# Altium schematic sheet Current_SenseSchematic.SchDoc (part 2 of 3)
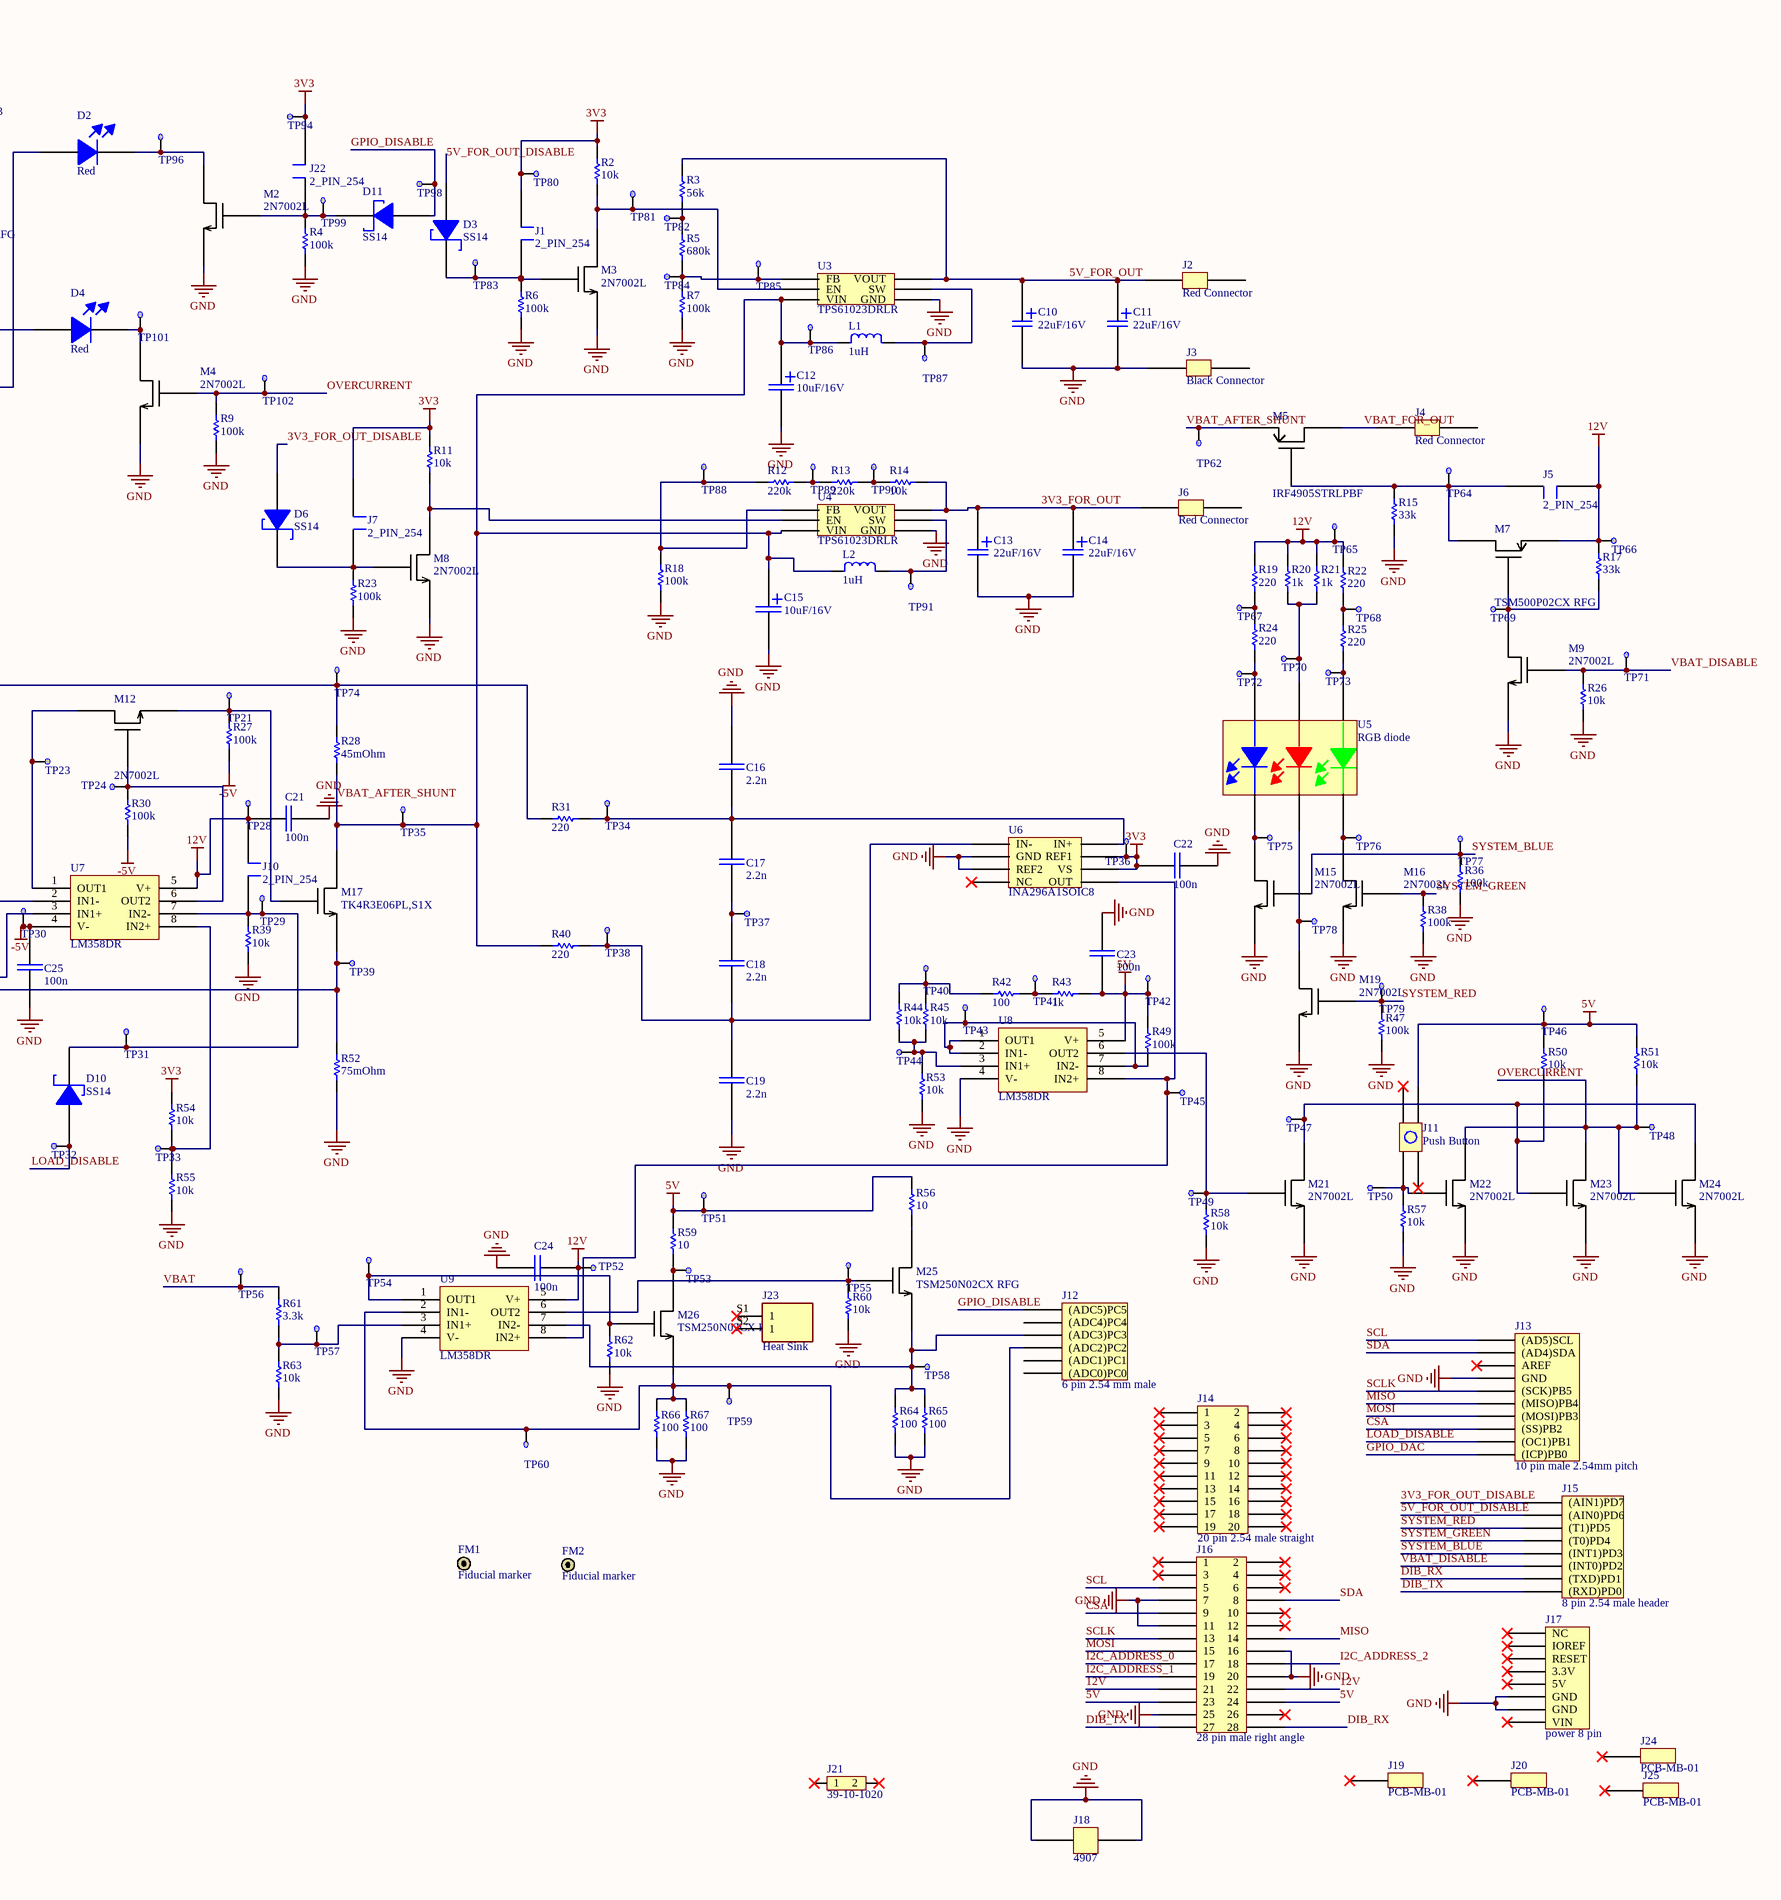
[diagram p2: Current_SenseSchematic.SchDoc, right]
## Library data of the parts
C1 C8 C9 = C1206C105K5RACTU: Multilayer Ceramic Capacitor, 1 uF, 50 V, ± 10%, X7R, 1206 [3216 Metric]; Manufacturer: KEMET; Voltage: 50V; Supplier: Farnell; Supplier Part Number: 1288207; Manufacturer Part Number: C1206C105K5RACTU; RoHS: Yes; Category: Ceramic Capacitors; Stock: 92059; Pricing: 10=0.106, 100=0.065, 500=0.057, 1000=0.05 (GBP); Mounting Technology: Surface Mount; Case/Package: 1206; Pins: 2; Case Code (Imperial): 1206; Case Code (Metric): 3216; Dielectric Material: Ceramic; Min Operating Temperature: -55°C; Max Operating Temperature: 125°C; Value: 1uF; Tolerance: 10%; Packaging: Tape and Reel; Dielectric: X7R; Termination: SMD/SMT; Package Quantity: 1; Voltage Rating: 50V; Voltage Rating (DC): 50V; Series: C; Construction: Flat; Voltage Rating (AC): 50V; Length: 3.2mm; Width: 0.063inch; Height: 1mm; Depth: 1.6mm; Thickness: 0.043inch; Radiation Hardening: No; Reach SVHC Compliant: No; RoHS Compliant: Yes; ComponentLink1URL: https://datasheet.ciiva.com/6074/kem-c1002-x7r-smd-6074697.pdf?src-supplier=Farnell; ComponentLink1Description: https://datasheet.ciiva.com/6074/kem-c1002-x7r-smd-6074697.pdf?src-supplier=Farnell; ComponentLink2URL: https://datasheet.ciiva.com/7730/kem-c1002-x7r-smd-7730086.pdf?src-supplier=Element14; ComponentLink2Description: https://datasheet.ciiva.com/7730/kem-c1002-x7r-smd-7730086.pdf?src-supplier=Element14; ComponentLink3URL: https://datasheet.ciiva.com/22749/1918693-22749725.pdf?src-supplier=Element14; ComponentLink3Description: https://datasheet.ciiva.com/22749/1918693-22749725.pdf?src-supplier=Element14
C2 = 12061A332FAT2A: Cap Ceramic 0.0033uF 100V C0G 1% SMD 1206 125°C Embossed T/R; Manufacturer: Kyocera AVX; Supplier: Mouser; Supplier Part Number: 581-12061A332FAT2A; Manufacturer Part Number: 12061A332FAT2A; RoHS: Yes; Category: Ceramic Capacitors; Stock: 5389; ComponentLink1URL: https://datasheet.ciiva.com/11536/ccog-11536655.pdf?src-supplier=Avnet; ComponentLink1Description: https://datasheet.ciiva.com/11536/ccog-11536655.pdf?src-supplier=Avnet; ComponentLink2URL: https://datasheet.ciiva.com/218/ccog-218522.pdf?src-supplier=Digi-Key; ComponentLink2Description: https://datasheet.ciiva.com/218/ccog-218522.pdf?src-supplier=Digi-Key; Supplier 1: Mouser; Supplier Part Number 1: 581-12061A332FAT2A
C3 = 875585344001: Cap, 100Uf, 25V, Alu Elec, Hybrid, Smd Rohs Compliant: Yes |Wurth Elektronik 875585344001; Manufacturer: Wurth Electronics; ESR (Equivalent Series Resistance): 50mR; Leakage Current: 16uA; Ripple Current: 900mA; Voltage Rating: 16V; Supplier: Farnell; Supplier Part Number: 4171898; Manufacturer Part Number: 875585344001; RoHS: No; Category: Polymer Capacitors; Stock: 989; Pricing: 1=1.46, 50=1.25, 100=1.07, 250=0.957, 500=0.86, 1000=0.779, 5000=0.763, 10000=0.747 (GBP); Min Operating Temperature: -55°C; Max Operating Temperature: 125°C; Value: 100uF; Diameter: 6.3mm; Length: 5.8mm; Width: 6.5mm; Supplier 1: Mouser; Supplier Part Number 1: 710-875585344001
C4 = 12063C474JAT2A: Cap Ceramic 0.47uF 25V X7R 5% SMD 1206 125°C Embossed T/R; Manufacturer: Kyocera AVX; Supplier: Mouser; Supplier Part Number: 581-12063C474J; Manufacturer Part Number: 12063C474JAT2A; RoHS: Yes; Category: Ceramic Capacitors; Stock: 280; ComponentLink1URL: https://datasheet.ciiva.com/211/cx7r-211340.pdf?src-supplier=Digi-Key; ComponentLink1Description: https://datasheet.ciiva.com/211/cx7r-211340.pdf?src-supplier=Digi-Key; ComponentLink2URL: https://datasheet.ciiva.com/5426/cx7r-5426934.pdf?src-supplier=Mouser; ComponentLink2Description: https://datasheet.ciiva.com/5426/cx7r-5426934.pdf?src-supplier=Mouser
C5-C7 C20-C25 = 12065F104K4T2A: 1206 Standard 100nF Ceramic Multilayer Cap; 50VDC; +150C; X8R Dielectric; +/-10% SMD; Manufacturer: Kyocera AVX; Supplier: Farnell; Supplier Part Number: 4229722; Manufacturer Part Number: 12065F104K4T2A; RoHS: Yes; Category: Ceramic Capacitors; Stock: 8000; Pricing: 2000=0.063, 10000=0.045, 20000=0.044 (GBP); ComponentLink1URL: https://datasheet.ciiva.com/11787/0900766b80def347-11787814.pdf?src-supplier=Rs; ComponentLink1Description: https://datasheet.ciiva.com/11787/0900766b80def347-11787814.pdf?src-supplier=Rs; ComponentLink2URL: https://datasheet.ciiva.com/25796/55254-25796411.pdf?src-supplier=Farnell; ComponentLink2Description: https://datasheet.ciiva.com/25796/55254-25796411.pdf?src-supplier=Farnell; ComponentLink3URL: https://datasheet.ciiva.com/25796/55254-25796413.pdf?src-supplier=Farnell; ComponentLink3Description: https://datasheet.ciiva.com/25796/55254-25796413.pdf?src-supplier=Farnell; ComponentLink4URL: https://datasheet.ciiva.com/5411/cx8r-5411261.pdf?src-supplier=Mouser; ComponentLink4Description: https://datasheet.ciiva.com/5411/cx8r-5411261.pdf?src-supplier=Mouser; ComponentLink5URL: https://datasheet.ciiva.com/152/cauto-152120.pdf?src-supplier=Digikey; ComponentLink5Description: https://datasheet.ciiva.com/152/cauto-152120.pdf?src-supplier=Digikey; ComponentLink6URL: https://datasheet.ciiva.com/152/cauto-152121.pdf?src-supplier=Digikey; ComponentLink6Description: https://datasheet.ciiva.com/152/cauto-152121.pdf?src-supplier=Digikey; ComponentLink7URL: https://datasheet.ciiva.com/152/cauto-152122.pdf?src-supplier=Digikey; ComponentLink7Description: https://datasheet.ciiva.com/152/cauto-152122.pdf?src-supplier=Digikey; ComponentLink8URL: https://datasheet.ciiva.com/16315/cx8r-16315643.pdf?src-supplier=Future+Electronics; ComponentLink8Description: https://datasheet.ciiva.com/16315/cx8r-16315643.pdf?src-supplier=Future+Electronics
C10 C11 C13 C14 = MVJ16VC22RME60TP: Aluminum Electrolytic Capacitors - SMD 22uF 16V; Manufacturer: United Chemi-Con; Tolerance: 20%; Supplier: Mouser; Supplier Part Number: 661-MVJ16VC22RM; Manufacturer Part Number: MVJ16VC22RME60TP; RoHS: No; Category: Uncategorized; Case/Package: Aluminum; Min Operating Temperature: -40°C; Max Operating Temperature: 125°C; Packaging: Tape and Reel; Voltage Rating: 16V; Voltage Rating (DC): 16V; Value: 22uF; Package Quantity: 1000; Termination: SMD/SMT; Series: MVJ; Length: 5.7mm; RoHS Compliant: No; ComponentLink1URL: http://www.mouser.com/search/ProductDetail.aspx?r=661-EMVJ6R3ADA220MD6&countrycode=SB&currencycode=USD&src-supplier=Mouser; ComponentLink1Description: http://www.mouser.com/search/ProductDetail.aspx?r=661-EMVJ6R3ADA220MD6&countrycode=SB&currencycode=USD&src-supplier=Mouser
  C10: Supplier 1: Mouser; Supplier Part Number 1: 661-MVJ16VC22RM
C12 C15 = EEE-HA1C100R: Aluminum Electrolytic Capacitor, 10 uF, 16 V, ± 20%, 1000 hours @ 105°C, Radial Can - SMD; Manufacturer: Panasonic; Supplier: Farnell; Supplier Part Number: 2805786; Manufacturer Part Number: EEE-HA1C100R; RoHS: Yes; Category: Aluminum Electrolytic Capacitors; Stock: 4000; Pricing: 2000=0.05 (GBP); Width: 650um; Lead Free: 5697LeadFree; ComponentLink1URL: https://datasheet.ciiva.com/11777/0900766b8102e3f9-11777432.pdf?src-supplier=Rs; ComponentLink1Description: https://datasheet.ciiva.com/11777/0900766b8102e3f9-11777432.pdf?src-supplier=Rs; ComponentLink2URL: https://datasheet.ciiva.com/43459/1446029-43459815.pdf?src-supplier=Farnell; ComponentLink2Description: https://datasheet.ciiva.com/43459/1446029-43459815.pdf?src-supplier=Farnell; ComponentLink3URL: https://datasheet.ciiva.com/2983/aba0000ce3-2983985.pdf?src-supplier=Avnet; ComponentLink3Description: https://datasheet.ciiva.com/2983/aba0000ce3-2983985.pdf?src-supplier=Avnet; ComponentLink4URL: https://datasheet.ciiva.com/2985/aba0000ce3-2985640.pdf?src-supplier=Avnet; ComponentLink4Description: https://datasheet.ciiva.com/2985/aba0000ce3-2985640.pdf?src-supplier=Avnet; ComponentLink5URL: https://datasheet.ciiva.com/24071/aba0000ce3-259063-24071183.pdf?src-supplier=Mouser; ComponentLink5Description: https://datasheet.ciiva.com/24071/aba0000ce3-259063-24071183.pdf?src-supplier=Mouser; ComponentLink6URL: https://datasheet.ciiva.com/30262/33aba0000ce3-30262478.pdf?src-supplier=Onlinecomponents.com; ComponentLink6Description: https://datasheet.ciiva.com/30262/33aba0000ce3-30262478.pdf?src-supplier=Onlinecomponents.com; ComponentLink7URL: https://datasheet.ciiva.com/14593/70256712-14593785.pdf?src-supplier=Allied+Electronics; ComponentLink7Description: https://datasheet.ciiva.com/14593/70256712-14593785.pdf?src-supplier=Allied+Electronics; ComponentLink8URL: https://datasheet.ciiva.com/14604/70256712-14604238.pdf?src-supplier=Allied+Electronics; ComponentLink8Description: https://datasheet.ciiva.com/14604/70256712-14604238.pdf?src-supplier=Allied+Electronics; ComponentLink9URL: https://datasheet.ciiva.com/46376/1446029-46376825.pdf?src-supplier=Element14; ComponentLink9Description: https://datasheet.ciiva.com/46376/1446029-46376825.pdf?src-supplier=Element14; ComponentLink10URL: https://datasheet.ciiva.com/46386/1446029-46386252.pdf?src-supplier=Element14; ComponentLink10Description: https://datasheet.ciiva.com/46386/1446029-46386252.pdf?src-supplier=Element14
C16-C19 = 12065C222KAZ2A: 1206 2.2 nF 50V ±10 % Tolerance X7R Surface Mount Multilayer Ceramic Capacitor; Manufacturer: Kyocera AVX; Supplier: Mouser; Supplier Part Number: 581-12065C222KAZ2A; Manufacturer Part Number: 12065C222KAZ2A; RoHS: Yes; Category: Ceramic Capacitors; Stock: 2472; ComponentLink1URL: https://datasheet.ciiva.com/208/flexiterm-208276.pdf?src-supplier=Digi-Key; ComponentLink1Description: https://datasheet.ciiva.com/208/flexiterm-208276.pdf?src-supplier=Digi-Key; ComponentLink2URL: https://datasheet.ciiva.com/16315/cx7r-16315686.pdf?src-supplier=Future+Electronics; ComponentLink2Description: https://datasheet.ciiva.com/16315/cx7r-16315686.pdf?src-supplier=Future+Electronics
D1 D3 D6 D7 D10 D11 = SS14: SS14 Series 500 mV 1 A 40 V Max Reverse Voltage Schottky Rectifier - DO-214AC; Manufacturer: ON Semiconductor / Fairchild; Max Reverse Current: 200uA; Forward Current: 1A; Forward Voltage: 500mV; Max Repetitive Reverse Voltage (Vrrm): 40V; Max Forward Surge Current (Ifsm): 40A; Polarity: Standard; Supplier: Farnell; Supplier Part Number: 1467537; Manufacturer Part Number: SS14; RoHS: Yes; Category: Schottky Diodes; Stock: 4863; Pricing: 5=0.36, 10=0.272, 100=0.152, 500=0.103, 1000=0.0793, 2500=0.0707 (GBP); Mounting Technology: Surface Mount; Case/Package: DO-214AC; Pins: 2; Weight: 0.003739oz; Min Operating Temperature: -65°C; Max Operating Temperature: 125°C; Packaging: Tape and Reel; Package Quantity: 7500; Average Rectified Current: 1A; Peak Non-Repetitive Surge Current: 40A; Max Reverse Voltage (DC): 40V; Series: -; Termination: SMD/SMT; Voltage Rating (DC): 40V; Current Rating: 1A; Output Current: 1A; Current: 1A; Voltage: 40V; Length: 4.75mm; Width: 2.95mm; Height: 2.2mm; Radiation Hardening: No; Reach SVHC Compliant: No; RoHS Compliant: Yes; ComponentLink1URL: https://datasheet.ciiva.com/910/ss12-910696.pdf?src-supplier=Digi-Key; ComponentLink1Description: https://datasheet.ciiva.com/910/ss12-910696.pdf?src-supplier=Digi-Key; ComponentLink2URL: https://datasheet.ciiva.com/7965/1766303-7965241.pdf?src-supplier=Element14; ComponentLink2Description: https://datasheet.ciiva.com/7965/1766303-7965241.pdf?src-supplier=Element14; ComponentLink3URL: https://datasheet.ciiva.com/22651/1880990-22651980.pdf?src-supplier=Element14; ComponentLink3Description: https://datasheet.ciiva.com/22651/1880990-22651980.pdf?src-supplier=Element14
D2 D4 D8 = SML-LXL1206GC-TR: LED Red 20 mcd (Typ.) @ 25 C (Axial) 2.1 V (Typ.) @ 25 C (Forward) PCB; Manufacturer: Lumex; Supplier: Farnell; Supplier Part Number: 1610882; Manufacturer Part Number: SML-LXL1206GC-TR; RoHS: Yes; Category: LEDs; Stock: 1744; Pricing: 1=0.229, 25=0.166, 50=0.132, 100=0.0968, 250=0.0888, 500=0.0824, 1000=0.0743 (GBP); ComponentLink1URL: https://datasheet.ciiva.com/4689/sml-lxl1206gc-tr-115211-4689614.pdf?src-supplier=Mouser; ComponentLink1Description: https://datasheet.ciiva.com/4689/sml-lxl1206gc-tr-115211-4689614.pdf?src-supplier=Mouser; ComponentLink2URL: https://datasheet.ciiva.com/8073/sml-lxl1206gc-tr-8073089.pdf?src-supplier=Element14; ComponentLink2Description: https://datasheet.ciiva.com/8073/sml-lxl1206gc-tr-8073089.pdf?src-supplier=Element14; ComponentLink3URL: https://datasheet.ciiva.com/8072/sml-lxl1206gc-tr-8072901.pdf?src-supplier=Element14; ComponentLink3Description: https://datasheet.ciiva.com/8072/sml-lxl1206gc-tr-8072901.pdf?src-supplier=Element14; ComponentLink4URL: https://datasheet.ciiva.com/41804/sml-lxl1206gc-tr-41804550.pdf?src-supplier=Digi-Key; ComponentLink4Description: https://datasheet.ciiva.com/41804/sml-lxl1206gc-tr-41804550.pdf?src-supplier=Digi-Key; ComponentLink5URL: https://datasheet.ciiva.com/16426/sml-lxl1206gc-tr-16426375.pdf?src-supplier=Future+Electronics; ComponentLink5Description: https://datasheet.ciiva.com/16426/sml-lxl1206gc-tr-16426375.pdf?src-supplier=Future+Electronics
D5 = SML-LXL1209SUGC-TR: Led, Quasarbrite, Green, T-3/4 (1.8Mm), 574 Nm, 2.2 V, 20 Ma, 170 Mcd Rohs Compliant: Yes; Manufacturer: Lumex; Supplier: Mouser; Supplier Part Number: 696-SMLLXL1209SUGCTR; Manufacturer Part Number: SML-LXL1209SUGC-TR; RoHS: Yes; Category: LEDs; Stock: 507; ComponentLink1URL: https://datasheet.ciiva.com/30105/sml-lxl1209sugc-tr-30105147.pdf?src-supplier=Onlinecomponents.com; ComponentLink1Description: https://datasheet.ciiva.com/30105/sml-lxl1209sugc-tr-30105147.pdf?src-supplier=Onlinecomponents.com; ComponentLink2URL: https://datasheet.ciiva.com/2111/sml-lxl1209sugc-tr-2111360.pdf?src-supplier=Digi-Key; ComponentLink2Description: https://datasheet.ciiva.com/2111/sml-lxl1209sugc-tr-2111360.pdf?src-supplier=Digi-Key; ComponentLink3URL: https://datasheet.ciiva.com/4689/sml-lxl1209sugc-tr-114142-4689389.pdf?src-supplier=Mouser; ComponentLink3Description: https://datasheet.ciiva.com/4689/sml-lxl1209sugc-tr-114142-4689389.pdf?src-supplier=Mouser; ComponentLink4URL: https://datasheet.ciiva.com/16488/sml-lxl1209sugc-tr-16488143.pdf?src-supplier=Future+Electronics; ComponentLink4Description: https://datasheet.ciiva.com/16488/sml-lxl1209sugc-tr-16488143.pdf?src-supplier=Future+Electronics; ComponentLink5URL: https://datasheet.ciiva.com/8072/sml-lxl1209sugc-tr-8072907.pdf?src-supplier=Element14; ComponentLink5Description: https://datasheet.ciiva.com/8072/sml-lxl1209sugc-tr-8072907.pdf?src-supplier=Element14; ComponentLink6URL: https://datasheet.ciiva.com/2111/sml-lxl1209sugc-tr-2111358.pdf?src-supplier=Digi-Key; ComponentLink6Description: https://datasheet.ciiva.com/2111/sml-lxl1209sugc-tr-2111358.pdf?src-supplier=Digi-Key; ComponentLink7URL: https://datasheet.ciiva.com/2111/sml-lxl1209sugc-tr-2111359.pdf?src-supplier=Digi-Key; ComponentLink7Description: https://datasheet.ciiva.com/2111/sml-lxl1209sugc-tr-2111359.pdf?src-supplier=Digi-Key
D9 = BZT55B3V3 L1G: MMELF, 500mW, 2%, Small Signal Zener Diode; Manufacturer: Taiwan Semiconductor; Zener Voltage: 3.3V; Impedance: 85R; Supplier: Digikey; Supplier Part Number: BZT55B3V3L1G-ND; Manufacturer Part Number: BZT55B3V3 L1G; RoHS: Yes; Category: Zener Diodes; Mounting Technology: Surface Mount; Min Operating Temperature: -65°C; Max Operating Temperature: 175°C; Packaging: Tape and Reel; Series: -; Tolerance: 2%; Max Power Dissipation: 500mW; RoHS Compliant: Yes
FM1 FM2 = FM
J1 J5 J7 J10 J22 = XG8T-0241: Conn Unshrouded Header PL 2 POS 2.54mm Solder ST Thru-Hole; Manufacturer: Omron; Supplier: Mouser; Supplier Part Number: 653-XG8T0241; Manufacturer Part Number: XG8T-0241; RoHS: Yes; Category: Connectors; Stock: 1546; ComponentLink1URL: https://datasheet.ciiva.com/48561/en-xg8t-48561514.pdf?src-supplier=Avnet; ComponentLink1Description: https://datasheet.ciiva.com/48561/en-xg8t-48561514.pdf?src-supplier=Avnet
J2 J4 J6 = 571-0500: Connector, Pcb, 2CONTACTS; Manufacturer: Deltron; Supplier: Farnell; Supplier Part Number: 1494593; Manufacturer Part Number: 571-0500; RoHS: No; Category: Connectors; Stock: 998; Pricing: 1=1.3, 5=1.23, 10=1.15, 20=1.12 (GBP); ComponentLink1URL: http://www.farnell.com/datasheets/2007771.pdf?src-supplier=Farnell; ComponentLink1Description: http://www.farnell.com/datasheets/2007771.pdf?src-supplier=Farnell; ComponentLink2URL: https://datasheet.octopart.com/571-0500-Deltron-datasheet-62043102.pdf?src-supplier=Newark; ComponentLink2Description: https://datasheet.octopart.com/571-0500-Deltron-datasheet-62043102.pdf?src-supplier=Newark
J3 = 571-0100: Connector, Pcb, 2CONTACTS; Manufacturer: Deltron; Supplier: Farnell; Supplier Part Number: 1494595; Manufacturer Part Number: 571-0100; RoHS: Yes; Category: Connectors; Stock: 971; Pricing: 1=1.17, 5=1.1, 10=1.04, 20=1.02 (GBP); ComponentLink1URL: https://datasheet.ciiva.com/12074/deltron-571-0100-4mm-90deg-single-socket-data-372703-12074316.pdf?src-supplier=Mouser; ComponentLink1Description: https://datasheet.ciiva.com/12074/deltron-571-0100-4mm-90deg-single-socket-data-372703-12074316.pdf?src-supplier=Mouser
J8 = 282834-2: Conn PC Board Terminal Block Receptacle 2 POS 2.54mm RA Through Hole 10A; Manufacturer: TE Connectivity; Plating: Brass,Steel; Number of Contacts: 2; Max Voltage Rating (AC): 150V; Number of Levels: 1; Interlock: No (Without); Screwless Terminal Block: Yes (With); Gender: Male; Connector System: 5937ConnectorSystem; Wire Gauge (Max): 30AWG; Thread Size: M1.6; Tail Length: 3.4mm; Approvals: UL; Supplier: Farnell; Supplier Part Number: 2112482; Manufacturer Part Number: 282834-2; RoHS: Yes; Category: Terminal Blocks; Stock: 25386; Pricing: 1=1.33, 10=1, 100=0.692, 500=0.667, 1000=0.599, 2500=0.596 (GBP); Mounting Technology: Through Hole; Housing Color: Green; Contact Plating: Tin; Contact Material: Brass; Color: Green; Housing Material: Polyamide; Material: Nylon; Min Operating Temperature: -40°C; Max Operating Temperature: 105°C; Number of Rows: 1; Termination: Solder; Orientation: Straight; Current Rating: 10A; Voltage Rating: 150V; Package Quantity: 300; Packaging: Bulk; Number of Positions: 2; Number of Positions Per Level: 2; Current: 10A; Voltage: 150V; Max Supply Voltage (AC): 150V; Number of Circuits: 2; Connector Type: Receptacle; Max Current Rating: 10A; Screw Flange: No (Without); Side Stackable: Yes (With); Series: Buchanan; Number of Poles: 2; Closed End: No (Without); Operating Supply Voltage: 150V; Length: 5.54mm; Width: 6.5mm; Pitch: 2.54mm; Wire Gauge (Min): 30AWG; Depth: 6.5mm; Wire/Cable Gauge: 30AWG; Radiation Hardening: No; Lead Free: Lead Free; Flammability Rating: UL94 V-0; RoHS Compliant: Yes; Reach SVHC Compliant: Unknown; ComponentLink1URL: https://datasheet.ciiva.com/16386/282834-2-16386363.pdf?src-supplier=Future+Electronics; ComponentLink1Description: https://datasheet.ciiva.com/16386/282834-2-16386363.pdf?src-supplier=Future+Electronics; ComponentLink2URL: https://datasheet.ciiva.com/11758/0900766b80e7dc96-11758675.pdf?src-supplier=Rs; ComponentLink2Description: https://datasheet.ciiva.com/11758/0900766b80e7dc96-11758675.pdf?src-supplier=Rs; ComponentLink3URL: https://datasheet.ciiva.com/3141/eng-cs-1308389-eurostyle-terminal-blocks-0607-3141115.pdf?src-supplier=Avnet; ComponentLink3Description: https://datasheet.ciiva.com/3141/eng-cs-1308389-eurostyle-terminal-blocks-0607-3141115.pdf?src-supplier=Avnet; ComponentLink4URL: https://datasheet.ciiva.com/15169/getdatasheetpartid-155864-15169558.pdf?src-supplier=Verical; ComponentLink4Description: https://datasheet.ciiva.com/15169/getdatasheetpartid-155864-15169558.pdf?src-supplier=Verical; ComponentLink5URL: https://datasheet.ciiva.com/30166/eng-cs-1308389-eurostyle-terminal-blocks-0607-30166974.pdf?src-supplier=Onlinecomponents.com; ComponentLink5Description: https://datasheet.ciiva.com/30166/eng-cs-1308389-eurostyle-terminal-blocks-0607-30166974.pdf?src-supplier=Onlinecomponents.com; ComponentLink6URL: https://datasheet.ciiva.com/14609/70086732-14609670.pdf?src-supplier=Allied+Electronics; ComponentLink6Description: https://datasheet.ciiva.com/14609/70086732-14609670.pdf?src-supplier=Allied+Electronics; ComponentLink7URL: https://datasheet.ciiva.com/823/eng-cd-282834-c1-823453.pdf?src-supplier=Digikey; ComponentLink7Description: https://datasheet.ciiva.com/823/eng-cd-282834-c1-823453.pdf?src-supplier=Digikey
J9 = 292133-2: Connector, Header, 2Pos, 1Rows, 2Mm Rohs Compliant: Yes; Manufacturer: TE Connectivity; Supplier: Farnell; Supplier Part Number: 3398412; Manufacturer Part Number: 292133-2; RoHS: Yes; Stock: 19850; Pricing: 10=0.332, 100=0.275, 500=0.223, 1000=0.219, 2500=0.214, 5000=0.21 (GBP); ComponentLink1URL: https://datasheet.ciiva.com/734/eng-cd-292133-p-734147.pdf?src-supplier=Digikey; ComponentLink1Description: https://datasheet.ciiva.com/734/eng-cd-292133-p-734147.pdf?src-supplier=Digikey; ComponentLink2URL: https://datasheet.ciiva.com/30063/eng-ds-1-1773455-8-ct-connector-series-qrg-0909-30063356.pdf?src-supplier=Onlinecomponents.com; ComponentLink2Description: https://datasheet.ciiva.com/30063/eng-ds-1-1773455-8-ct-connector-series-qrg-0909-30063356.pdf?src-supplier=Onlinecomponents.com
J11 = DTSM-61N-V-B: Switch Tactile N.O. SPST Round Button Gull Wing 0.05A 12VDC 1.57N SMD Tube; Manufacturer: Diptronics; Supplier: Mouser; Supplier Part Number: 113-DTSM-61N-V-B; Manufacturer Part Number: DTSM-61N-V-B; RoHS: Yes; ComponentLink1URL: https://datasheet.ciiva.com/26337/707546-da-01-en-smd-taster-26337236.pdf?src-supplier=Conrad; ComponentLink1Description: https://datasheet.ciiva.com/26337/707546-da-01-en-smd-taster-26337236.pdf?src-supplier=Conrad
J12 = M20-9730646: 2.54mm (0.1") Pitch SIL Vertical PC Tail Pin Header, 7mm mating pin height, tin, 6 contacts; Manufacturer: Harwin; Current Rating: 3A; Voltage Rating: 750V; Number of Positions: 6; Pitch: 0.1inch; Supplier: Mouser; Supplier Part Number: 855-M20-9730646; Manufacturer Part Number: M20-9730646; RoHS: Yes; Category: Headers and Wire Housings; Stock: 1326; Mounting Technology: Through Hole; Case/Package: SIL; Color: Black; Contact Plating: Tin; Contact Material: Brass; Housing Material: Nylon; Package Quantity: 1000; Number of Rows: 1; Packaging: Bulk; Termination: Solder; Series: M20; Contact Type: Male Pin; Contact Mating Length: 0.276inch; RoHS Compliant: Yes; ComponentLink1URL: https://datasheet.ciiva.com/6830/m20-973-6830695.pdf?src-supplier=Digi-Key; ComponentLink1Description: https://datasheet.ciiva.com/6830/m20-973-6830695.pdf?src-supplier=Digi-Key
J13 = 5-825433-0: Conn Unshrouded Header HDR 50 POS 2.54mm Solder ST Thru-Hole Box; Manufacturer: TE Connectivity; Supplier: Farnell; Supplier Part Number: 3417736; Manufacturer Part Number: 5-825433-0; RoHS: Yes; Category: Connectors; Stock: 4533; Pricing: 1=4.18, 10=3.07, 100=2.72, 250=2.35, 500=2.3, 1000=2.26 (GBP); ComponentLink1URL: https://datasheet.ciiva.com/11751/0900766b800304ef-11751249.pdf?src-supplier=Rs; ComponentLink1Description: https://datasheet.ciiva.com/11751/0900766b800304ef-11751249.pdf?src-supplier=Rs; ComponentLink2URL: https://datasheet.ciiva.com/34402/58254330-34402258.pdf?src-supplier=Onlinecomponents.com; ComponentLink2Description: https://datasheet.ciiva.com/34402/58254330-34402258.pdf?src-supplier=Onlinecomponents.com; ComponentLink3URL: https://datasheet.ciiva.com/29369/001094861-da-01-en-stiftleiste-1-reihig-5-0825433-0-29369884.pdf?src-supplier=Conrad; ComponentLink3Description: https://datasheet.ciiva.com/29369/001094861-da-01-en-stiftleiste-1-reihig-5-0825433-0-29369884.pdf?src-supplier=Conrad; ComponentLink4URL: https://datasheet.ciiva.com/7891/27856-7891753.pdf?src-supplier=Element14; ComponentLink4Description: https://datasheet.ciiva.com/7891/27856-7891753.pdf?src-supplier=Element14
J14 = M20-9721045: Conn, Header, 20POS, 2ROW, 2.54MM Rohs Compliant: Yes; Manufacturer: Harwin; Number of Positions: 20; Row Spacing: 0.1inch; Supplier: Mouser; Supplier Part Number: 855-M20-9721045; Manufacturer Part Number: M20-9721045; RoHS: Yes; Category: Headers and Wire Housings; Stock: 997; Mounting Technology: Through Hole; Contact Plating: Gold; Color: Black; Number of Rows: 2; Package Quantity: 500; Packaging: Bulk; Termination: Solder; Number of Contacts: 20; Gender: Male; Series: M20; Contact Type: Male Pin; Pitch: 2.54mm; Contact Mating Length: 0.276inch; Radiation Hardening: No; RoHS Compliant: Yes; ComponentLink1URL: http://www.mouser.com/ds/2/181/Harwin_Product_Catalog_page_207-1131241.pdf?src-supplier=Mouser; ComponentLink1Description: http://www.mouser.com/ds/2/181/Harwin_Product_Catalog_page_207-1131241.pdf?src-supplier=Mouser; ComponentLink2URL: https://cdn.harwin.com/pdfs/Harwin_Product_Catalog_page_207.pdf?src-supplier=Digi-Key; ComponentLink2Description: https://cdn.harwin.com/pdfs/Harwin_Product_Catalog_page_207.pdf?src-supplier=Digi-Key; ComponentLink3URL: http://www.harwin.com/include/downloads/pdfs/2010PAGE129.PDF?src-supplier=Avnet; ComponentLink3Description: http://www.harwin.com/include/downloads/pdfs/2010PAGE129.PDF?src-supplier=Avnet
J15 = 0878910808: 2.54MM Pitch, Srsw, T/h, H; Manufacturer: Molex; Supplier: Mouser; Supplier Part Number: 538-87891-0808; Manufacturer Part Number: 0878910808; RoHS: No; Category: Connectors; Stock: 11193
J16 = 0717640028: Headers & Wire Housings 28P 2R BRKAWAY HDR 2.54MM RA L-PRO SN; Manufacturer: Molex; Current Rating: 3A; Voltage Rating: 250V; Number of Positions: 28; Row Spacing: 0.1inch; Glow Wire Compliant: Non-compliant; Supplier: Mouser; Supplier Part Number: 538-71764-0028; Manufacturer Part Number: 0717640028; RoHS: Yes; Category: Uncategorized; Stock: 1579; Mounting Technology: Through Hole; Color: Black; Contact Material: Bronze,Brass,Copper Alloy; Contact Plating: Gold,Tin; Housing Color: Black; Material: Brass; Housing Material: Thermoplastic; Min Operating Temperature: -40°C; Max Operating Temperature: 105°C; Package Quantity: 1; Number of Rows: 2; Packaging: Rail/Tube; Termination: Solder; Orientation: Right Angle; Number of Circuits: 28; Series: C-Grid® 71764; Contact Type: Male Pin; Number of Contacts: 28; Length: 35.56mm; Width: 2.29mm; Height: 5.08mm; Pitch: 2.54mm; Contact Mating Length: 0.24inch; Depth: 13.54mm; ELV: Compliant; Lead Free: Lead Free; Flammability Rating: UL94 V-0; RoHS Compliant: Yes; ComponentLink1URL: https://datasheet.ciiva.com/6862/717640004-sd-6862000.pdf?src-supplier=Digikey; ComponentLink1Description: https://datasheet.ciiva.com/6862/717640004-sd-6862000.pdf?src-supplier=Digikey; ComponentLink2URL: https://datasheet.ciiva.com/10073/0717640028-pcb-headers-10073873.pdf?src-supplier=Avnet; ComponentLink2Description: https://datasheet.ciiva.com/10073/0717640028-pcb-headers-10073873.pdf?src-supplier=Avnet; ComponentLink3URL: https://datasheet.ciiva.com/13564/0717640028-pcb-headers-228955-13564572.pdf?src-supplier=Mouser; ComponentLink3Description: https://datasheet.ciiva.com/13564/0717640028-pcb-headers-228955-13564572.pdf?src-supplier=Mouser
J17 = 0878910808_Power: 2.54MM Pitch, Srsw, T/h, H; Manufacturer: Molex; Supplier: Mouser; Supplier Part Number: 538-87891-0808; Manufacturer Part Number: 0878910808; RoHS: No; Category: Connectors; Stock: 11193
J18 = 4907: USB C SMT / THM Jack Connector - Power Only - Pack of 10; Manufacturer: Keystone Electronics; Supplier: Mouser; Supplier Part Number: 534-4907; Manufacturer Part Number: 4907; RoHS: Yes; Category: Terminals; Stock: 64745; Pricing: 1=0.35, 10=0.284, 50=0.284, 100=0.219, 1000=0.165, 10000=0.139 (USD); ComponentLink1URL: https://datasheet.ciiva.com/16507/m60-2p52-16507735.pdf?src-supplier=Future+Electronics; ComponentLink1Description: https://datasheet.ciiva.com/16507/m60-2p52-16507735.pdf?src-supplier=Future+Electronics; Supplier 1: Mouser; Supplier Part Number 1: 534-4907
J19 J20 J24 J25 = PCB-MB-01: Installation BLock Colour: Transparent Material: Nylon 6/6 RMS-01; Manufacturer: Essentra; Supplier: Mouser; Supplier Part Number: 144-PCB-MB-01; Manufacturer Part Number: PCB-MB-01; RoHS: No; Stock: 1233; Pricing: 1=0.36, 10=0.269, 50=0.269, 100=0.227, 1000=0.202, 10000=0.169 (USD); Mounting Technology: PCB; Color: Clear; Material: Nylon; Package Quantity: 1000; Packaging: Bag; Series: PCB-MB; Lead Free: Lead Free; ComponentLink1URL: https://datasheet.ciiva.com/11835/0900766b8002e29e-11835600.pdf?src-supplier=Rs; ComponentLink1Description: https://datasheet.ciiva.com/11835/0900766b8002e29e-11835600.pdf?src-supplier=Rs; ComponentLink2URL: https://datasheet.ciiva.com/29838/essentra-components-2014-catalog-711-29838609.pdf?src-supplier=Digikey; ComponentLink2Description: https://datasheet.ciiva.com/29838/essentra-components-2014-catalog-711-29838609.pdf?src-supplier=Digikey
  J19 J24 J25: Supplier 1: Mouser; Supplier Part Number 1: 144-PCB-MB-01
J21 = 0039301020+: Connector Wire to Board Header 2 Position 4.2mm Solder Right Angle Thru-Hole Bag; Manufacturer: Molex; Supplier: Mouser; Supplier Part Number: 538-39-30-1020; Manufacturer Part Number: 0039301020+; RoHS: No; Category: Uncategorized; Stock: 5943; Pricing: 1=0.56, 10=0.385, 50=0.385, 100=0.341, 1000=0.304, 10000=0.268 (USD); ComponentLink1URL: https://www.molex.com/pdm_docs/sd/039301020_sd.pdf?src-supplier=Digikey; ComponentLink1Description: https://www.molex.com/pdm_docs/sd/039301020_sd.pdf?src-supplier=Digikey; Supplier 1: Mouser; Supplier Part Number 1: 538-39-30-1020
J23 = 529702B02500G: Heat Sink Passive TO-220 Radial Thru-Hole Aluminum 5.5°C/W Black Anodized; Manufacturer: Aavid Thermalloy; Shape: Fins,Rectangular; Thermal Resistance @ Forced Air Flow (100 LFM): 4°C/W; Supplier: Mouser; Supplier Part Number: 532-529702B25G; Manufacturer Part Number: 529702B02500G; RoHS: Yes; Category: Heat Sinks; Stock: 2189; Pricing: 1=1.99, 10=1.79, 50=1.79, 100=1.63, 1000=1.44, 10000=1.26 (USD); Mounting Technology: Bolt,PC Pin,Solder; Case/Package: Radial; Color: Black; Package Cooled: TO-220; Material: Aluminium,Anodized; Finish: Anodized; Type: Passive; Package Quantity: 500; Natural Thermal Resistance: 5.5°C/W; Length: 41.91mm; Width: 1.65inch; Height: 25.4mm; Height Off Base: 1inch; Depth: 25.4mm; Radiation Hardening: No; Reach SVHC Compliant: No; Lead Free: Lead Free; RoHS Compliant: Yes; ComponentLink1URL: https://datasheet.ciiva.com/15182/getdatasheetpartid-42755-15182474.pdf?src-supplier=Verical; ComponentLink1Description: https://datasheet.ciiva.com/15182/getdatasheetpartid-42755-15182474.pdf?src-supplier=Verical; ComponentLink2URL: https://datasheet.ciiva.com/1004/aavid-board-level-heatsinks-catalog-1004100.pdf?src-supplier=Digikey; ComponentLink2Description: https://datasheet.ciiva.com/1004/aavid-board-level-heatsinks-catalog-1004100.pdf?src-supplier=Digikey; Supplier 1: Mouser; Supplier Part Number 1: 532-529702B25G
L1 L2 = PA4333.102NLT: Drum Core Shielded Power Inductor Wirewound Ferrite 1uH 20% 1MHz 9.5A SMD T/R; Manufacturer: Pulse; Supplier: Digikey; Supplier Part Number: 553-3294-1-ND; Manufacturer Part Number: PA4333.102NLT; RoHS: Yes; Category: Fixed Inductors; Stock: 11976; ComponentLink1URL: http://productfinder.pulseeng.com/products/datasheets/P762.pdf?src-supplier=Digikey; ComponentLink1Description: http://productfinder.pulseeng.com/products/datasheets/P762.pdf?src-supplier=Digikey; ComponentLink2URL: https://datasheet.octopart.com/PA4333.102NLT-Pulse-datasheet-137333239.pdf?src-supplier=Sager+Electronics; ComponentLink2Description: https://datasheet.octopart.com/PA4333.102NLT-Pulse-datasheet-137333239.pdf?src-supplier=Sager+Electronics; ComponentLink3URL: https://datasheet.octopart.com/PA4333.102NLT-Pulse-datasheet-151940517.pdf?src-supplier=Master+Electronics; ComponentLink3Description: https://datasheet.octopart.com/PA4333.102NLT-Pulse-datasheet-151940517.pdf?src-supplier=Master+Electronics
M1 M7 M13 = TSM500P02CX RFG: Transistor Mosfet P-ch 20V 4.7A 3-PIN SOT-23 T/r; Manufacturer: Taiwan Semiconductor; Supplier: Mouser; Supplier Part Number: 821-TSM500P02CXRFG; Manufacturer Part Number: TSM500P02CX RFG; RoHS: No; Stock: 12597; ComponentLink1URL: http://www.taiwansemi.com/products/datasheet/TSM500P02CX_A14.pdf?src-supplier=Digi-Key; ComponentLink1Description: http://www.taiwansemi.com/products/datasheet/TSM500P02CX_A14.pdf?src-supplier=Digi-Key; ComponentLink2URL: https://www.taiwansemi.com/assets/uploads/datasheet/TSM500P02CX_B1811.pdf?src-supplier=Digi-Key; ComponentLink2Description: https://www.taiwansemi.com/assets/uploads/datasheet/TSM500P02CX_B1811.pdf?src-supplier=Digi-Key
M2-M4 M6 M8 M9 M12 M14-M16 M18-M24 = 2N7002L: Mosfet, N-ch, Vdss 60VDC, Rds(on) 7.5 Ohms, ID+/-115MA, SOT-23 (TO-236), Pd 225MW, -55C; Manufacturer: ON Semiconductor / Fairchild; Drain to Source Voltage (Vdss): 60V; Continuous Drain Current (ID): 115mA; Rds On Max: 7.5R; Input Capacitance: 50pF; Max Power Dissipation: 200mW; Gate to Source Voltage (Vgs): 20V; Turn-Off Delay Time: 15.6ns; Polarity: N-CHANNEL; Element Configuration: Single; Number of Channels: 1; Turn-On Delay Time: 4.35ns; Supplier: Farnell; Supplier Part Number: 2929771; RoHS: Yes; Category: MOSFETs; Stock: 100524; Pricing: 5=0.217, 10=0.15, 100=0.0927, 500=0.0622, 1000=0.0418, 3000=0.0375, 6000=0.0289, 12000=0.0284 (GBP); Mounting Technology: Surface Mount; Case/Package: SOT-23-3; Pins: 3; Weight: 0.03g; Contact Plating: Tin,Matte; Min Operating Temperature: -55°C; Max Operating Temperature: 150°C; Packaging: Tape and Reel; Series: -; Drain to Source Resistance: 7.5R; Package Quantity: 3000; Drain to Source Breakdown Voltage: 60V; RoHS Compliant: Yes; Lead Free: Lead Free; ComponentLink1URL: http://www.farnell.com/datasheets/2354034.pdf?src-supplier=Farnell; ComponentLink1Description: http://www.farnell.com/datasheets/2354034.pdf?src-supplier=Farnell; ComponentLink2URL: http://www.mouser.com/ds/2/149/2N7002L-469242.pdf?src-supplier=Mouser; ComponentLink2Description: http://www.mouser.com/ds/2/149/2N7002L-469242.pdf?src-supplier=Mouser; ComponentLink3URL: https://www.fairchildsemi.com/datasheets/2N/2N7002L.pdf?src-supplier=Avnet; ComponentLink3Description: https://www.fairchildsemi.com/datasheets/2N/2N7002L.pdf?src-supplier=Avnet; ComponentLink4URL: https://www.onsemi.com/pub/Collateral/2N7002L-D.PDF?src-supplier=Digi-Key; ComponentLink4Description: https://www.onsemi.com/pub/Collateral/2N7002L-D.PDF?src-supplier=Digi-Key; ComponentLink5URL: https://www.fairchildsemi.com/datasheets/2N/2N7002L.pdf?src-supplier=Digi-Key; ComponentLink5Description: https://www.fairchildsemi.com/datasheets/2N/2N7002L.pdf?src-supplier=Digi-Key; ComponentLink6URL: http://www.farnell.com/datasheets/2354034.pdf?src-supplier=Newark; ComponentLink6Description: http://www.farnell.com/datasheets/2354034.pdf?src-supplier=Newark; ComponentLink7URL: https://datasheet.octopart.com/2N7002L-ON-Semiconductor-datasheet-93401092.pdf?src-supplier=Future+Electronics; ComponentLink7Description: https://datasheet.octopart.com/2N7002L-ON-Semiconductor-datasheet-93401092.pdf?src-supplier=Future+Electronics; ComponentLink8URL: https://datasheet.octopart.com/2N7002L-ON-Semiconductor-datasheet-140570130.pdf?src-supplier=Arrow.cn; ComponentLink8Description: https://datasheet.octopart.com/2N7002L-ON-Semiconductor-datasheet-140570130.pdf?src-supplier=Arrow.cn; Manufacturer Part Number: 2N7002L
M5 M10 M11 = IRF4905STRLPBF: Transistor: P-MOSFET; unipolar; -55V; -74A; 0.02ohm; 3.8W; -55+175 deg.C; SMD; TO263 (D2PAK); Manufacturer: Infineon; Continuous Drain Current (ID): 42A; Input Capacitance: 3.5nF; Max Power Dissipation: 170W; Rds On Max: 20mR; Threshold Voltage: 4V; Gate to Source Voltage (Vgs): 20V; Turn-Off Delay Time: 51ns; Turn-On Delay Time: 20ns; Dual Supply Voltage: 55V; Number of Elements: 1; Rise Time: 99ns; Element Configuration: Single; Fall Time: 64ns; Value: 20mR; Supplier: Farnell; Supplier Part Number: 1298511; Manufacturer Part Number: IRF4905STRLPBF; RoHS: Yes; Category: MOSFETs; Stock: 22288; Pricing: 1=2.81, 10=2.24, 25=1.86, 100=1.48, 800=1.23, 1600=1.22, 3200=1.21 (GBP); Mounting Technology: Surface Mount; Case/Package: D2PAK; Pins: 3; Min Operating Temperature: -55°C; Max Operating Temperature: 150°C; Drain to Source Voltage (Vdss): -55V; Packaging: Cut Tape; Series: HEXFET®; Max Dual Supply Voltage: -55V; Nominal Vgs: 4V; Package Quantity: 800; Power Dissipation: 170W; Termination: SMD/SMT; Drain to Source Breakdown Voltage: -55V; Drain to Source Resistance: 20mR; Number of Channels: 1; On-State Resistance: 20mR; Length: 10.67mm; Width: 9.65mm; Height: 4.83mm; Radiation Hardening: No; Lead Free: Contains Lead; RoHS Compliant: Yes; Reach SVHC Compliant: No; Halogen Free: Halogen Free
M17 = TK4R3E06PL,S1X: X35 Pb-F Power Mosfet Transistor To-220 Pd=87W F=1Mhz; Manufacturer: Toshiba; Supplier: Mouser; Supplier Part Number: 757-TK4R3E06PLS1X; Manufacturer Part Number: TK4R3E06PL,S1X; RoHS: No; Category: MOSFETs; Stock: 24527; Pricing: 1=1.44, 10=1.17, 50=1.17, 100=0.922, 1000=0.608, 10000=0.544 (USD); Supplier 1: Mouser; Supplier Part Number 1: 757-TK4R3E06PLS1X
M25 M26 = TSM250N02CX RFG: Transistor Power MOSFET N-CH 20V 5.8A 3-Pin SOT-23 T/R; Manufacturer: Taiwan Semiconductor; Rds On Max: 25mR; Input Capacitance: 535pF; Max Power Dissipation: 1.56W; Supplier: Mouser; Supplier Part Number: 821-TSM250N02CXRFG; Manufacturer Part Number: TSM250N02CX RFG; RoHS: Yes; Stock: 27930; Mounting Technology: Surface Mount; Case/Package: SOT-23; Packaging: Cut Tape; Drain to Source Voltage (Vdss): 20V; Continuous Drain Current (ID): 5.8A; Series: -; RoHS Compliant: Yes; ComponentLink1URL: http://www.taiwansemi.com/products/datasheet/TSM250N02CX_A14.pdf?src-supplier=Digikey; ComponentLink1Description: http://www.taiwansemi.com/products/datasheet/TSM250N02CX_A14.pdf?src-supplier=Digikey
R1 R19 R22 R24 R25 R31 R40 = RCC1206220RFKEA: Res, Aec-Q200, 220R, 1%, 0.5W, 1206 Rohs Compliant: Yes |Vishay RCC1206220RFKEA; Manufacturer: Vishay Dale; Supplier: Farnell; Supplier Part Number: 3755557; Manufacturer Part Number: RCC1206220RFKEA; RoHS: No; Category: Chip SMD Resistors; Stock: 4400; Pricing: 10=0.082, 100=0.037, 500=0.031, 1000=0.026, 2500=0.024, 5000=0.023 (GBP); ComponentLink1URL: https://datasheet.octopart.com/RCC1206220RFKEA-Vishay-datasheet-151891907.pdf?src-supplier=Element14; ComponentLink1Description: https://datasheet.octopart.com/RCC1206220RFKEA-Vishay-datasheet-151891907.pdf?src-supplier=Element14
  R1: Supplier 1: Mouser; Supplier Part Number 1: 71-RCC1206220RFKEA
R2 R11 R14 R26 R39 R44 R45 R50 R51 R53-R55 R57 R58 R60 R62 R63 R68-R70 = CR1206-JW-103ELF: SMD Chip Resistor, 10 kOhm, ± 5%, 250 mW, 1206 [3216 Metric], Thick Film, General Purpose; Manufacturer: Bourns; Supplier: Farnell; Supplier Part Number: 4158422; Manufacturer Part Number: CR1206-JW-103ELF; RoHS: Yes; Category: Chip SMD Resistors; Stock: 50000; Pricing: 5000=0.006, 25000=0.005, 50000=0.004 (GBP); ComponentLink1URL: https://datasheet.ciiva.com/6547/chpreztr-6547381.pdf?src-supplier=Digi-Key; ComponentLink1Description: https://datasheet.ciiva.com/6547/chpreztr-6547381.pdf?src-supplier=Digi-Key; ComponentLink2URL: https://datasheet.ciiva.com/6547/chpreztr-6547382.pdf?src-supplier=Digi-Key; ComponentLink2Description: https://datasheet.ciiva.com/6547/chpreztr-6547382.pdf?src-supplier=Digi-Key; ComponentLink3URL: https://datasheet.ciiva.com/6547/chpreztr-6547383.pdf?src-supplier=Digi-Key; ComponentLink3Description: https://datasheet.ciiva.com/6547/chpreztr-6547383.pdf?src-supplier=Digi-Key; ComponentLink4URL: https://datasheet.ciiva.com/9122/chpreztr-9122327.pdf?src-supplier=Avnet; ComponentLink4Description: https://datasheet.ciiva.com/9122/chpreztr-9122327.pdf?src-supplier=Avnet; ComponentLink5URL: https://datasheet.ciiva.com/9122/chpreztr-9122330.pdf?src-supplier=Avnet; ComponentLink5Description: https://datasheet.ciiva.com/9122/chpreztr-9122330.pdf?src-supplier=Avnet; ComponentLink6URL: https://datasheet.ciiva.com/48692/001055546-da-01-en-smd-wid-cr1206-jw-103elf-10k-ohm-1-4w-48692038.pdf?src-supplier=Conrad; ComponentLink6Description: https://datasheet.ciiva.com/48692/001055546-da-01-en-smd-wid-cr1206-jw-103elf-10k-ohm-1-4w-48692038.pdf?src-supplier=Conrad
R3 = CR1206-FX-5602ELF: Res Thick Film 1206 56K Ohm 1% 1/4W ±100ppm/°C Molded SMD SMD Paper Tape on Plastic Reel; Manufacturer: Bourns; Supplier: Mouser; Supplier Part Number: 652-CR1206FX-5602ELF; Manufacturer Part Number: CR1206-FX-5602ELF; RoHS: Yes; Category: Chip SMD Resistors; Stock: 64104; ComponentLink1URL: https://datasheet.ciiva.com/9121/chpreztr-9121174.pdf?src-supplier=Avnet; ComponentLink1Description: https://datasheet.ciiva.com/9121/chpreztr-9121174.pdf?src-supplier=Avnet; ComponentLink2URL: https://datasheet.ciiva.com/5546/chpreztr-5546127.pdf?src-supplier=Mouser; ComponentLink2Description: https://datasheet.ciiva.com/5546/chpreztr-5546127.pdf?src-supplier=Mouser
R4 R6 R7 R9 R18 R23 R27 R30 R32 R35 R36 R38 R46 R47 R49 = RCG1206100KJNEA: Res Thick Film 1206 100kOhm 1/4W Molded Paper T/R; Manufacturer: Vishay Dale; Value: 100kR; Tolerance: 5%; Power Rating: 250mW; Voltage Rating: 200V; Temperature Coefficient: 200ppm/°C; Supplier: Mouser; Supplier Part Number: 71-RCG1206100KJNEA; Manufacturer Part Number: RCG1206100KJNEA; RoHS: Yes; Category: Chip SMD Resistors; Stock: 12738; Case/Package: 1206; Weight: 0.000353oz; Case Code (Metric): 3216; Case Code (Imperial): 1206; Min Operating Temperature: -55°C; Max Operating Temperature: 155°C; Package Quantity: 1; Packaging: Tape and Reel; Number of Terminations: 2; Termination: SMD/SMT; Max Power Dissipation: 250mW; Series: RCG; Length: 0.126inch; Width: 0.063inch; Height: 0.024inch; RoHS Compliant: Yes; ComponentLink1URL: http://www.mouser.com/ds/2/427/rcge3-254226.pdf?src-supplier=Mouser; ComponentLink1Description: http://www.mouser.com/ds/2/427/rcge3-254226.pdf?src-supplier=Mouser; ComponentLink2URL: http://www.vishay.com/docs/20047/rcge3.pdf?src-supplier=Digi-Key; ComponentLink2Description: http://www.vishay.com/docs/20047/rcge3.pdf?src-supplier=Digi-Key
R5 = CR1206-JW-684ELF: RES SMD 680K OHM 5% 1/4W 1206; Manufacturer: Bourns; Supplier: Mouser; Supplier Part Number: 652-CR1206JW-684ELF; Manufacturer Part Number: CR1206-JW-684ELF; RoHS: Yes; Category: Chip SMD Resistors; Stock: 21398; ComponentLink1URL: https://datasheet.ciiva.com/5544/chpreztr-5544750.pdf?src-supplier=Mouser; ComponentLink1Description: https://datasheet.ciiva.com/5544/chpreztr-5544750.pdf?src-supplier=Mouser; ComponentLink2URL: https://datasheet.ciiva.com/9119/chpreztr-9119445.pdf?src-supplier=Avnet; ComponentLink2Description: https://datasheet.ciiva.com/9119/chpreztr-9119445.pdf?src-supplier=Avnet
R8 R10 R34 = CRCW1206560RFKEC: Res Thkflm D25/1206 560R Ohm 1% 100 ET6 E3 SMD; Manufacturer: Vishay Dale; Max Power Dissipation: 250mW; Temperature Coefficient: 100ppm/°C; Supplier: Mouser; Supplier Part Number: 71-CRCW1206560RFKEC; Manufacturer Part Number: CRCW1206560RFKEC; RoHS: Yes; Category: Chip SMD Resistors; Stock: 19686; Case/Package: 1206; Min Operating Temperature: -55°C; Max Operating Temperature: 155°C; Package Quantity: 20000; Packaging: Tape and Reel; Value: 560R; Number of Terminations: 2; Tolerance: 1%; Features: Automotive AEC-Q200; Series: CRCW; Length: 0.126inch; Width: 0.063inch; Height: 0.024inch; Lead Free: Lead Free; RoHS Compliant: Yes; ComponentLink1URL: http://www.vishay.com/docs/20035/dcrcwe3.pdf?src-supplier=Digi-Key; ComponentLink1Description: http://www.vishay.com/docs/20035/dcrcwe3.pdf?src-supplier=Digi-Key
R12 R13 = CHP1206AJW-224ELF: Resistor Thick Film 220kOhm 5% 2-Pin 1206 T/R; Manufacturer: Bourns; Supplier: Farnell; Supplier Part Number: 3769442; Manufacturer Part Number: CHP1206AJW-224ELF; RoHS: Yes; Category: Chip SMD Resistors; Stock: 3450; Pricing: 10=0.237, 100=0.165, 500=0.132, 1000=0.117, 2500=0.107, 5000=0.096, 25000=0.086, 50000=0.075 (GBP)
R15 R17 R41 = RC1206JR-0733KL: SMD Chip Resistor, 33 kOhm, ± 5%, 250 mW, 1206 [3216 Metric], Thick Film, General Purpose; Manufacturer: Yageo; Voltage Rating (AC): 200V; Supplier: Farnell; Supplier Part Number: 9240705; Manufacturer Part Number: RC1206JR-0733KL; RoHS: Yes; Category: Chip SMD Resistors; Stock: 6490; Pricing: 10=0.02, 100=0.012, 500=0.01, 1000=0.009, 2500=0.007, 5000=0.004, 25000=0.0035, 50000=0.003 (GBP); ComponentLink1URL: https://datasheet.ciiva.com/29181/402729-da-01-en-smd-widerstand-chip1206-33-kohm-29181369.pdf?src-supplier=Conrad; ComponentLink1Description: https://datasheet.ciiva.com/29181/402729-da-01-en-smd-widerstand-chip1206-33-kohm-29181369.pdf?src-supplier=Conrad; ComponentLink2URL: https://datasheet.ciiva.com/16747/pyu-rc1206-51-rohs-l-4-16747052.pdf?src-supplier=Future+Electronics; ComponentLink2Description: https://datasheet.ciiva.com/16747/pyu-rc1206-51-rohs-l-4-16747052.pdf?src-supplier=Future+Electronics; ComponentLink3URL: https://datasheet.ciiva.com/7857/444357-7857487.pdf?src-supplier=Element14; ComponentLink3Description: https://datasheet.ciiva.com/7857/444357-7857487.pdf?src-supplier=Element14
R16 = CR1206-JW-105ELF: SMD Chip Resistor, 1 MOhm, ± 5%, 250 mW, 1206 [3216 Metric], Thick Film, General Purpose; Manufacturer: Bourns; Voltage Rating (DC): 200V; Supplier: Farnell; Supplier Part Number: 2469514; Manufacturer Part Number: CR1206-JW-105ELF; RoHS: Yes; Category: Chip SMD Resistors; Stock: 23740; Pricing: 10=0.009, 100=0.008, 500=0.005, 1000=0.0049, 2500=0.0048 (GBP); Thickness: 610um; ComponentLink1URL: https://datasheet.ciiva.com/9123/chpreztr-9123660.pdf?src-supplier=Avnet; ComponentLink1Description: https://datasheet.ciiva.com/9123/chpreztr-9123660.pdf?src-supplier=Avnet
R20 R21 R37 R43 R48 = RCA12061K00JNEA: Res Thick Film 1206 1kOhm 5% 1/4W ±200ppm/K Molded Paper Tape; Manufacturer: Vishay Dale; Value: 1kR; Max Power Dissipation: 250mW; Temperature Coefficient: 200ppm/°C; Supplier: Mouser; Supplier Part Number: 71-RCA12061K00JNEA; Manufacturer Part Number: RCA12061K00JNEA; RoHS: Yes; Category: Chip SMD Resistors; Stock: 41679; Case/Package: 1206; Case Code (Metric): 3216; Case Code (Imperial): 1206; Min Operating Temperature: -55°C; Max Operating Temperature: 155°C; Packaging: Cut Tape; Number of Terminations: 2; Tolerance: 5%; Features: Automotive AEC-Q200,Anti-Sulfur; Series: RCA; Ratings: AEC-Q200; RoHS Compliant: Yes; ComponentLink1URL: http://www.vishay.com/docs/20037/rcae3.pdf?src-supplier=Digi-Key; ComponentLink1Description: http://www.vishay.com/docs/20037/rcae3.pdf?src-supplier=Digi-Key
R28 = WSLP1206R0450FEA: CURRENT SENSE, RESISTOR, WSLP1206.0451%EAe3 | Vishay Dale WSLP1206R0450FEA; Supplier: Digikey; Supplier Part Number: WSLP1206R0450FEA-ND; Manufacturer: Vishay; Manufacturer Part Number: WSLP1206R0450FEA; RoHS: Yes; Category: Chip SMD Resistors; Pricing: 4000=0.30548 (USD); RoHS Compliant: Yes; Supplier 1: Digikey; Supplier Part Number 1: WSLP1206R0450FEA-ND
R29 = CR1206-FX-6801ELF: Res Thick Film 1206 6.8K Ohm 1% 1/4W ±100ppm/°C Molded SMD SMD Paper Tape on Plastic Reel; Manufacturer: Bourns; Supplier: Mouser; Supplier Part Number: 652-CR1206FX-6801ELF; Manufacturer Part Number: CR1206-FX-6801ELF; RoHS: Yes; Category: Chip SMD Resistors; Stock: 52345; ComponentLink1URL: https://datasheet.ciiva.com/9122/chpreztr-9122586.pdf?src-supplier=Avnet; ComponentLink1Description: https://datasheet.ciiva.com/9122/chpreztr-9122586.pdf?src-supplier=Avnet
R33 R42 R64-R67 = CR1206-JW-101ELF: SMD Chip Resistor, 100 Ohm, ± 5%, 250 mW, 1206 [3216 Metric], Thick Film, General Purpose; Manufacturer: Bourns; Supplier: Farnell; Supplier Part Number: 2469513; Manufacturer Part Number: CR1206-JW-101ELF; RoHS: Yes; Category: Chip SMD Resistors; Stock: 4; Pricing: 10=0.004 (GBP); ComponentLink1URL: https://datasheet.ciiva.com/9120/chpreztr-9120757.pdf?src-supplier=Avnet; ComponentLink1Description: https://datasheet.ciiva.com/9120/chpreztr-9120757.pdf?src-supplier=Avnet; ComponentLink2URL: https://datasheet.ciiva.com/6958/1856384-6958682.pdf?src-supplier=Newark; ComponentLink2Description: https://datasheet.ciiva.com/6958/1856384-6958682.pdf?src-supplier=Newark; ComponentLink3URL: https://datasheet.ciiva.com/5544/chpreztr-5544406.pdf?src-supplier=Mouser; ComponentLink3Description: https://datasheet.ciiva.com/5544/chpreztr-5544406.pdf?src-supplier=Mouser
R52 = TLRP3A30CR075FTE: Res Current Sense Metal Strip 2512 0.075 Ohm 1% 3W ±25ppm/°C Molded Emboss T/R; Manufacturer: CGS; Supplier: Farnell; Supplier Part Number: 3828744; Manufacturer Part Number: TLRP3A30CR075FTE; RoHS: No; Category: Chip SMD Resistors; Stock: 3894; Pricing: 10=0.328, 100=0.228, 500=0.184, 1000=0.152, 2000=0.149, 4000=0.146, 20000=0.143, 40000=0.14 (GBP); Packaging: 10Packaging; Power Rating: 3W
R56 R59 = CMP1206AFX-10R0ELF: Resistor, ResHighPowerA 1206 10R 1% 3/4W TC100; Manufacturer: Bourns; Supplier: Farnell; Supplier Part Number: 3769502; Manufacturer Part Number: CMP1206AFX-10R0ELF; RoHS: Yes; Category: Chip SMD Resistors; Stock: 4706; Pricing: 10=0.137, 100=0.083, 500=0.074, 1000=0.065, 2500=0.056, 5000=0.046, 25000=0.044, 50000=0.041 (GBP)